# Altium schematic sheet PowerSupply.SchDoc
size A
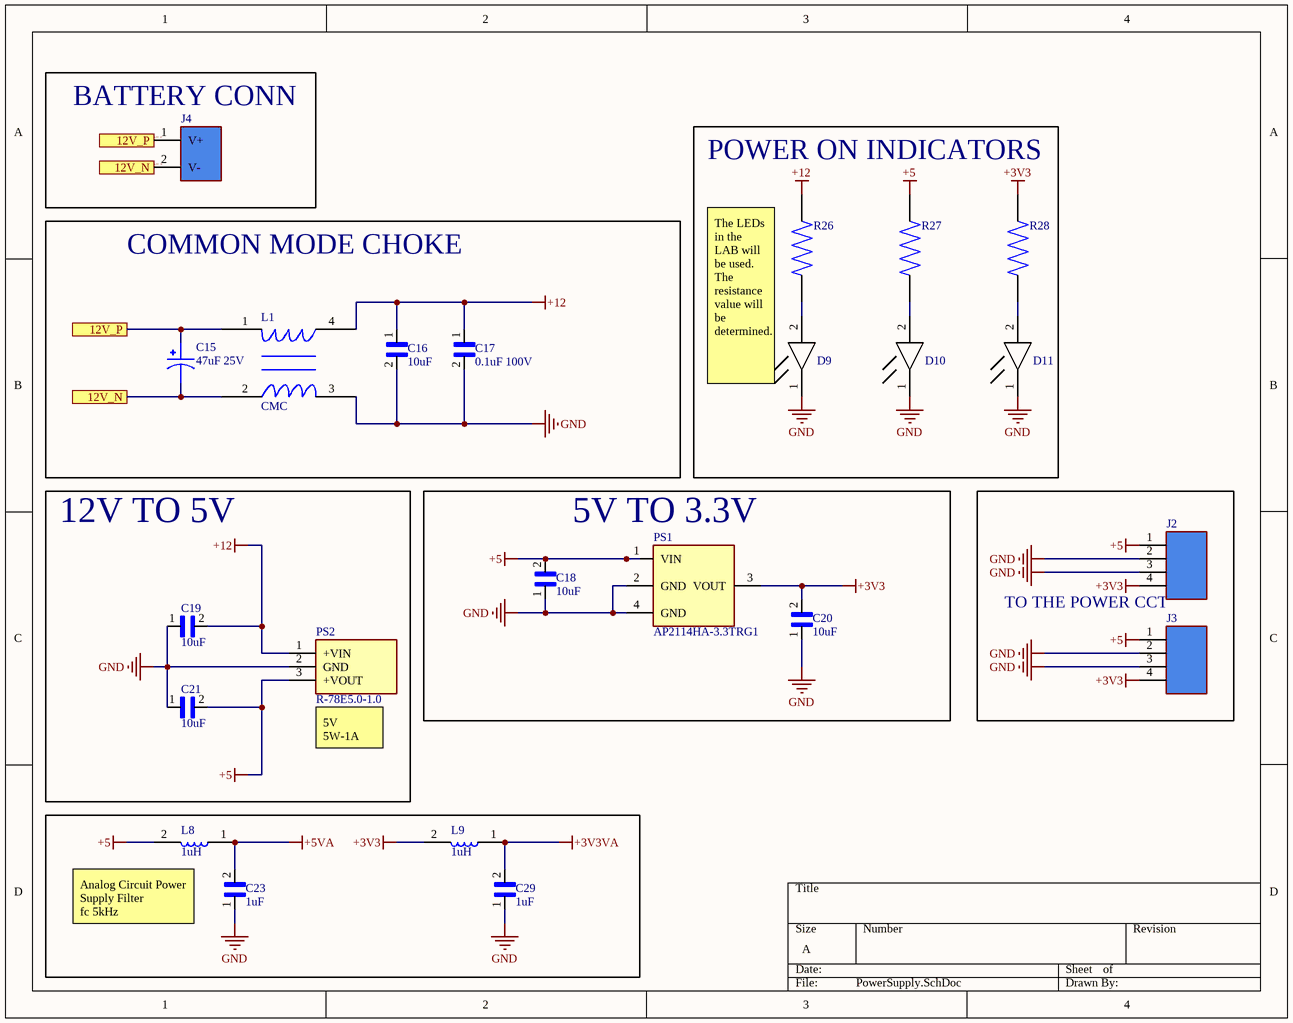
[diagram p0: PowerSupply.SchDoc]

## Parts
C15  47uF 25V  [EEE-HC1E470XP]
C16  10uF  [CAP 0805(2012 metric)]
C17  0.1uF 100V  [CAP 0805(2012 metric)]
C18  10uF  [CAP 0805(2012 metric)]
C19  10uF  [CAP 0805(2012 metric)]
C20  10uF  [CAP 0805(2012 metric)]
C21  10uF  [CAP 0805(2012 metric)]
C23  1uF  [CAP 0805(2012 metric)]
C29  1uF  [CAP 0805(2012 metric)]
D9  LED 17-21/Y2C-AN1P2/3T  [17-21/Y2C-AN1P2/3T]  (value not drawn)
D10  LED 17-21/Y2C-AN1P2/3T  [17-21/Y2C-AN1P2/3T]  (value not drawn)
D11  LED 17-21/Y2C-AN1P2/3T  [17-21/Y2C-AN1P2/3T]  (value not drawn)
J2  4POS1ROW  [4POS 1 ROW]  (value not drawn)
J3  4POS1ROW  [4POS 1 ROW]  (value not drawn)
J4  2 POS CONN  [2 POS CONN]  (value not drawn)
L1  CMC  [ACM7060-701-2PL-TL01]
L8  1uH  [IND 0805]
L9  1uH  [IND 0805]
PS1  AP2114HA-3.3TRG1  [SOT230P700X180-4N]
PS2  R-78E5.0-1.0  [R78E5010]
R26  1.24k  [RES 0805(2012 metric)]  (value not drawn)
R27  1.24k  [RES 0805(2012 metric)]  (value not drawn)
R28  1.24k  [RES 0805(2012 metric)]  (value not drawn)

## Blocks framed on the sheet
BATTERY CONN: J4
POWER ON INDICATORS: D9-D11 R26-R28
COMMON MODE CHOKE: C15-C17 L1
12V TO 5V: C19 C21 PS2
5V TO 3.3V: C18 C20 PS1
TO THE POWER CCT: J2 J3

## Ports
12V_N, 12V_P

## Nets
+3V3: C20.2 J2.4 J3.4 L9.2 PS1.3(VOUT) R28.2
+3V3VA: C29.2 L9.1
+5: C18.2 C21.2 J2.1 J3.1 L8.2 PS1.1(VIN) PS2.3(+VOUT) R27.2
+5VA: C23.2 L8.1
+12: C16.1 C17.1 C19.2 L1.4 PS2.1(+VIN) R26.2
GND: C16.2 C17.2 C18.1 C19.1 C20.1 C21.1 C23.1 C29.1 D9.1(Cathode) D10.1(Cathode) D11.1(Cathode) J2.2 J2.3 J3.2 J3.3 L1.3 PS1.2(GND) PS1.4(GND) PS2.2(GND)
12V_N: C15.2 J4.2(V-) L1.2 ; port 12V_N
12V_P: C15.1 J4.1(V+) L1.1 ; port 12V_P
NetD9_2: D9.2(Anode) R26.1
NetD10_2: D10.2(Anode) R27.1
NetD11_2: D11.2(Anode) R28.1

## Notes on the sheet
- The LEDs in the LAB will be used.
  The resistance value will be determined.
- (near PS2) 5V
  5W-1A
- Analog Circuit Power Supply Filter
  fc 5kHz

## Library data of the parts
C15 = EEE-HC1E470XP
C16 C18-C21 C23 C29 = 10uF 25 VDC: 10uF %10 tolerance 25VDC 0805
D9-D11 = LED
L1 = ACM7060
L8 L9 = 1uH 0805: 1µH Shielded Multilayer Inductor 1.15A 60mOhm 0805 (2012 Metric)
PS2 = R-78E5.0-1.0: Power Supply; Manufacturer_Name: RECOM Power; Datasheet Link: http://www.recom-power.com/pdf/Innoline/R-78Exx-1.0.pdf; Height: 10.4mm; Manufacturer_Part_Number: R-78E5.0-1.0; Mouser Part Number: 919-R-78E5.0-1.0; Mouser Price/Stock: https://www.mouser.co.uk/ProductDetail/RECOM-Power/R-78E50-10/?qs=T0XSgvH75d4EsZCU9I5HVA%3D%3D; Arrow Part Number: R-78E5.0-1.0; Arrow Price/Stock: https://www.arrow.com/en/products/r-78e5.0-1.0/recom-power
R26-R28 = 1.24k 0805